# Altium schematic sheet ClassD-DemoBoard-Schematic.SchDoc
size A3; SheetNumber: 1; SheetTotal: 1; SPICEModelCacheMOUJDJAJ: <root> / <DocumentId>MOUJDJAJ</DocumentId> / </root>
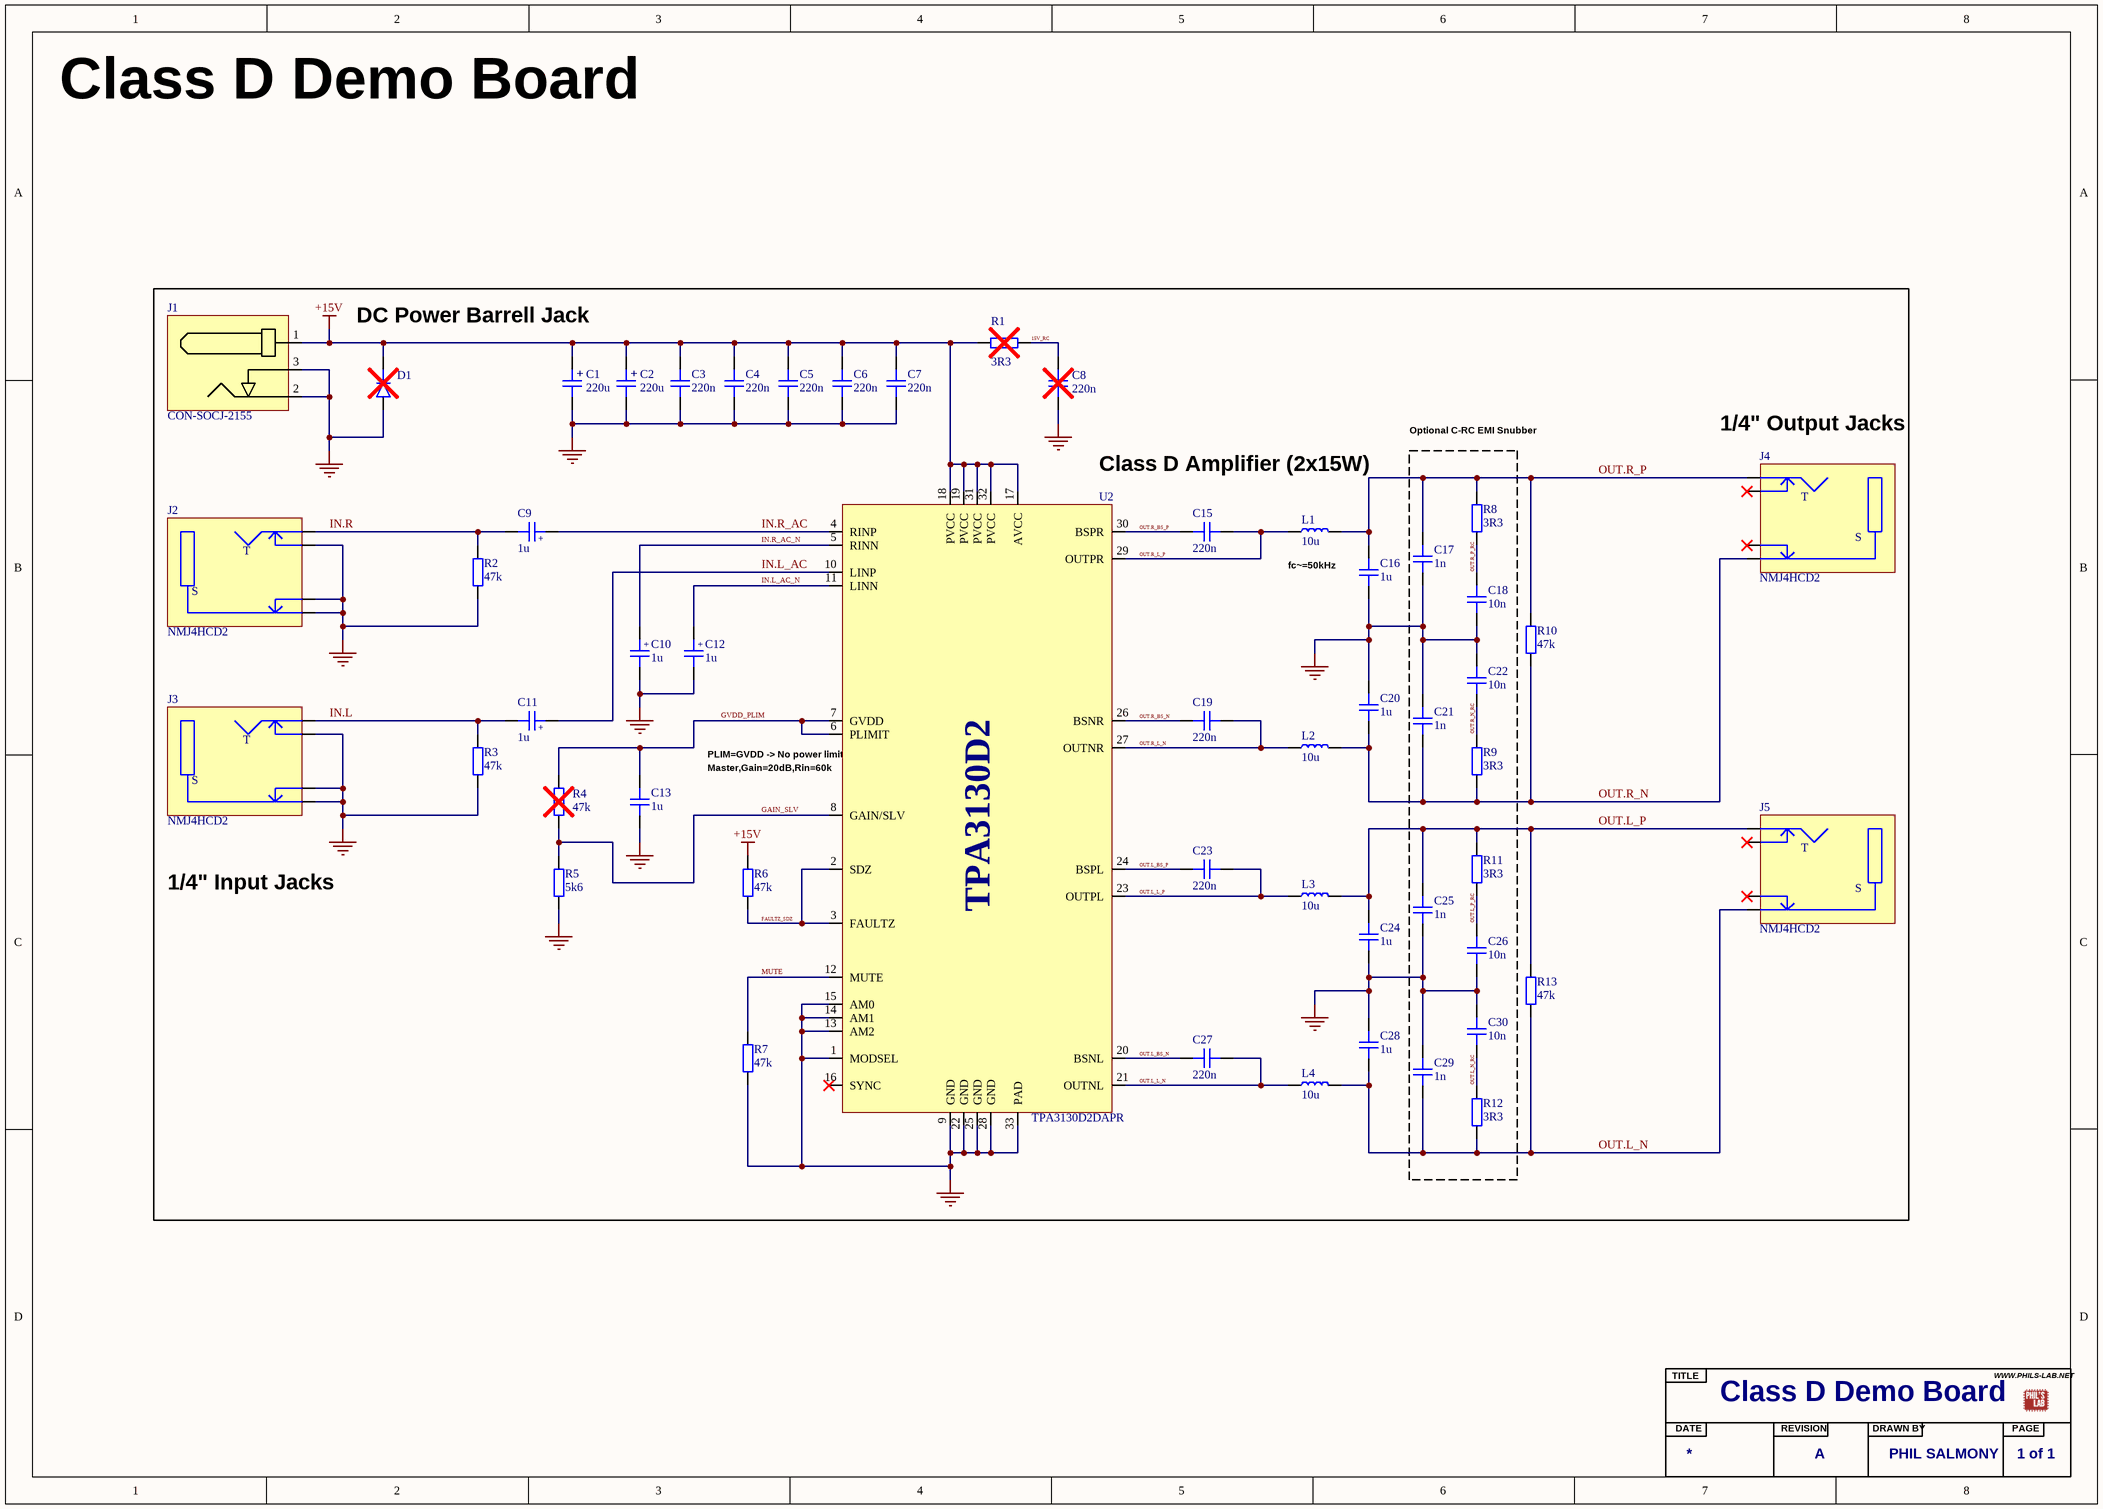
[diagram p0: ClassD-DemoBoard-Schematic.SchDoc]

## Parts
C1  220u  [CAP_AE_SMD_D6MM3_H8MM]
C2  220u  [CAP_AE_SMD_D6MM3_H8MM]
C3  220n  [CAP_0603]
C4  220n  [CAP_0603]
C5  220n  [CAP_0603]
C6  220n  [CAP_0603]
C7  220n  [CAP_0603]
C8  220n  [CAP_0603]  (no BOM)
C9  1u  [CAP_TANT_0603]
C10  1u  [CAP_TANT_0603]
C11  1u  [CAP_TANT_0603]
C12  1u  [CAP_TANT_0603]
C13  1u  [CAP_0603]
C15  220n  [CAP_0603]
C16  1u  [CAP_0603]
C17  1n  [CAP_0603]
C18  10n  [CAP_0603]
C19  220n  [CAP_0603]
C20  1u  [CAP_0603]
C21  1n  [CAP_0603]
C22  10n  [CAP_0603]
C23  220n  [CAP_0603]
C24  1u  [CAP_0603]
C25  1n  [CAP_0603]
C26  10n  [CAP_0603]
C27  220n  [CAP_0603]
C28  1u  [CAP_0603]
C29  1n  [CAP_0603]
C30  10n  [CAP_0603]
D1  D_SMA  [DO-214AC-2 (SMA)]  (value not drawn)  (no BOM)
J1  CON-SOCJ-2155  [CON-SOCJ-2155]
J2  NMJ4HCD2  [NMJ4HCD2]
J3  NMJ4HCD2  [NMJ4HCD2]
J4  NMJ4HCD2  [NMJ4HCD2]
J5  NMJ4HCD2  [NMJ4HCD2]
L1  10u  [ASPI-4030S]
L2  10u  [ASPI-4030S]
L3  10u  [ASPI-4030S]
L4  10u  [ASPI-4030S]
R1  3R3  [RES_0603]  (no BOM)
R2  47k  [RES_0603]
R3  47k  [RES_0603]
R4  47k  [RES_0603]  (no BOM)
R5  5k6  [RES_0603]
R6  47k  [RES_0603]
R7  47k  [RES_0603]
R8  3R3  [RES_0603]
R9  3R3  [RES_0603]
R10  47k  [RES_0603]
R11  3R3  [RES_0603]
R12  3R3  [RES_0603]
R13  47k  [RES_0603]
TB?  SCHEMATIC_TITLE_BLOCK  (value not drawn)  (graphical)
U2  TPA3130D2DAPR  [TSSOP32-DAP]

## Blocks framed on the sheet
Optional C-RC EMI Snubber: C17 C18 C21 C22 C25 C26 C29 C30 R8 R9 R11 R12

## Nets
+15V: C1.1 C2.1 C3.2 C4.2 C5.2 C6.2 C7.2 D1.K J1.1 R1.2 R6.1 U2.17(AVCC) U2.18(PVCC) U2.19(PVCC) U2.31(PVCC) U2.32(PVCC)
GND: C1.2 C2.2 C3.1 C4.1 C5.1 C6.1 C7.1 C8.1 C10.K C12.K C13.2 C16.2 C17.2 C18.2 C20.1 C21.1 C22.1 C24.2 C25.2 C26.2 C28.1 C29.1 C30.1 D1.A J1.2 J1.3 J2.S J2.SN J2.TN J3.S J3.SN J3.TN R2.1 R3.1 R5.2 R7.2 U2.1(MODSEL) U2.9(GND) U2.13(AM2) U2.14(AM1) U2.15(AM0) U2.22(GND) U2.25(GND) U2.28(GND) U2.33(PAD)
15V_RC: C8.2 R1.1
FAULTZ_SDZ: R6.2 U2.2(SDZ) U2.3(FAULTZ)
GAIN_SLV: R4.2 R5.1 U2.8(GAIN/SLV)
GVDD_PLIM: C13.1 R4.1 U2.6(PLIMIT) U2.7(GVDD)
IN.L: C11.K J3.T R3.2
IN.L_AC: C11.A U2.10(LINP)
IN.L_AC_N: C12.A U2.11(LINN)
IN.R: C9.K J2.T R2.2
IN.R_AC: C9.A U2.4(RINP)
IN.R_AC_N: C10.A U2.5(RINN)
MUTE: R7.1 U2.12(MUTE)
OUT.L_BS_N: C27.2 U2.20(BSNL)
OUT.L_BS_P: C23.2 U2.24(BSPL)
OUT.L_L_N: C27.1 L4.1 U2.21(OUTNL)
OUT.L_L_P: C23.1 L3.1 U2.23(OUTPL)
OUT.L_N: C28.2 C29.2 J5.S L4.2 R12.1 R13.1
OUT.L_N_RC: C30.2 R12.2
OUT.L_P: C24.1 C25.1 J5.T L3.2 R11.2 R13.2
OUT.L_P_RC: C26.1 R11.1
OUT.R_BS_N: C19.2 U2.26(BSNR)
OUT.R_BS_P: C15.2 U2.30(BSPR)
OUT.R_L_N: C19.1 L2.1 U2.27(OUTNR)
OUT.R_L_P: C15.1 L1.1 U2.29(OUTPR)
OUT.R_N: C20.2 C21.2 J4.S L2.2 R9.1 R10.1
OUT.R_N_RC: C22.2 R9.2
OUT.R_P: C16.1 C17.1 J4.T L1.2 R8.2 R10.2
OUT.R_P_RC: C18.1 R8.1

Not connected (* = marked no-connect by the designer): J4 SN* TN*; J5 SN* TN*; U2 16(SYNC)*

## Notes on the sheet
- Class D Demo Board
- DC Power Barrell Jack
- (near J4) 1/4" Output Jacks
- (near U2) Class D Amplifier (2x15W)
- fc~=50kHz
- (near U2) PLIM=GVDD -> No power limit
- (near U2) Master,Gain=20dB,Rin=60k
- 1/4" Input Jacks
- (near TB?) Class D Demo Board
- (near TB?) A
- (near TB?) PHIL SALMONY
- 1 of 1
- (in symbol CAP_ALEL_D6MM3_H8MM) +
- (in symbol CAP_TANT_0603) +
- (in symbol SCHEMATIC_TITLE_BLOCK) TITLE; WWW.PHILS-LAB.NET; DATE; REVISION; DRAWN BY; PAGE
- (in symbol TPA3130D2DAPR) TPA3130D2

## Library data of the parts
C1 C2 = CAP_ALEL_D6MM3_H8MM: Capacitor SMD Aluminium Electrolytic 6.3mm Diameter 8mm Height; Manufacturer: Nichicon; Manufacturer Part Number: UCM1E221MCL1GS; Distributor Link: https://www.lcsc.com/product-detail/Aluminum-Electrolytic-Capacitors-SMD_Nichicon-UCM1E221MCL1GS_C340768.html; LCSC: C340768
C3-C8 C15 C19 C23 C27 = CAP_0603: Capacitor SMD 0603; Manufacturer: Samsung; Manufacturer Part Number: CL10B224KA8NNNC; Rating: 25V; Distributor Link: https://www.lcsc.com/product-detail/Multilayer-Ceramic-Capacitors-MLCC-SMD-SMT_Samsung-Electro-Mechanics-CL10B224KA8NNNC_C21120.html; LCSC: C21120; Dielectric: *
C9-C12 = CAP_TANT_0603: Capacitor SMD Tantalum 0603; Manufacturer: Vishay; Manufacturer Part Number: 298D105X0025M2T; Distributor Link: https://www.lcsc.com/product-detail/Tantalum-Capacitors_Vishay-Intertech-298D105X0025M2T_C1952840.html; LCSC: C1952840
C13 C16 C20 C24 C28 = CAP_0603: Capacitor SMD 0603; Manufacturer: Samsung; Manufacturer Part Number: CL10A105KB8NNNC; Rating: 50V; Distributor Link: https://www.lcsc.com/product-detail/Multilayer-Ceramic-Capacitors-MLCC-SMD-SMT_Samsung-Electro-Mechanics-CL10A105KB8NNNC_C15849.html; LCSC: C15849; Dielectric: *
C17 C21 C25 C29 = CAP_0603: Capacitor SMD 0603; Manufacturer: Samsung; Manufacturer Part Number: CL10B102KB8NNNC; Rating: 50V; Distributor Link: https://www.lcsc.com/product-detail/Multilayer-Ceramic-Capacitors-MLCC-SMD-SMT_Samsung-Electro-Mechanics-CL10B102KB8NNNC_C1588.html; LCSC: C1588; Dielectric: *
C18 C22 C26 C30 = CAP_0603: Capacitor SMD 0603; Manufacturer: FH; Manufacturer Part Number: 0603B103K500NT; Rating: 50V; Distributor Link: https://www.lcsc.com/product-detail/Multilayer-Ceramic-Capacitors-MLCC-SMD-SMT_FH-Guangdong-Fenghua-Advanced-Tech-0603B103K500NT_C57112.html; LCSC: C57112; Dielectric: *
D1 = D_SMA: Diode SMD SMA (DO-214AA)
J1 = CON-SOCJ-2155: DC Barrell Jack 2.1mm 30V 2.5A THT; Manufacturer: Gravitech; Manufacturer Part Number: CON-SOCJ-2155; Distributor Link: https://www.mouser.de/ProductDetail/Gravitech/CON-SOCJ-2155?qs=fkzBJ5HM%252BdCcpvFQyQZHtA%3D%3D&_gl=1*ni0d5y*_ga*MjU5MDE1MzgyLjE2NTQ4NDcxMjU.*_ga_15W4STQT4T*MTY5Njc2NjEwNi4yNTkuMS4xNjk2NzY2MTE4LjQ4LjAuMA..*_ga_1KQLCYKRX3*MTY5NTYzNTI2NS4xODkuMS4xNjk1NjM1MjcxLjU0LjAuMA..
J2-J5 = NMJ4HCD2: 1/4" Mono Jack, TS Switched; Manufacturer: Neutrik; Manufacturer Part Number: NMJ4HCD2; Distributor Link: https://www.mouser.de/ProductDetail/Neutrik/NMJ4HCD2?qs=SzdD80gJ2cAr9Xh3wJi7nw%3D%3D
L1-L4 = ASPI-4030S: Power Inductor SMD ASPI-4030S Series; Manufacturer: ABRACON; Manufacturer Part Number: ASPI-4030S-100M-T; Distributor Link: https://www.lcsc.com/product-detail/Power-Inductors_Abracon-LLC-ASPI-4030S-100M-T_C2050513.html; LCSC: C2050513
R1 R8 R9 R11 R12 = RES_0603: Resistor SMD 0603; Manufacturer: YAGEO; Manufacturer Part Number: RC0603JR-073R3L; Distributor Link: https://www.lcsc.com/product-detail/Chip-Resistor-Surface-Mount_YAGEO-RC0603JR-073R3L_C137627.html; LCSC: C137627
R2-R4 R6 R7 R10 R13 = RES_0603: Resistor SMD 0603; Manufacturer: UNI-ROYAL; Manufacturer Part Number: 0603WAF4702T5E; Distributor Link: https://www.lcsc.com/product-detail/Chip-Resistor-Surface-Mount_UNI-ROYAL-Uniroyal-Elec-0603WAF4702T5E_C25819.html; LCSC: C25819
R5 = RES_0603: Resistor SMD 0603; Manufacturer: UNI-ROYAL; Manufacturer Part Number: 0603WAF5601T5E; Distributor Link: https://www.lcsc.com/product-detail/Chip-Resistor-Surface-Mount_UNI-ROYAL-Uniroyal-Elec-0603WAF5601T5E_C23189.html; LCSC: C23189
TB? = SCHEMATIC_TITLE_BLOCK: Default Schematic Title Block (Phil's Lab)
U2 = TPA3130D2DAPR: 2x15W Filter-Free Class-D Stereo Amplifier With AM Avoidance; Manufacturer: Texas Instruments; Manufacturer Part Number: TPA3130D2DAPR; Distributor Link: https://www.lcsc.com/product-detail/Audio-Power-OpAmps_Texas-Instruments-TPA3130D2DAPR_C95206.html; LCSC: C95206